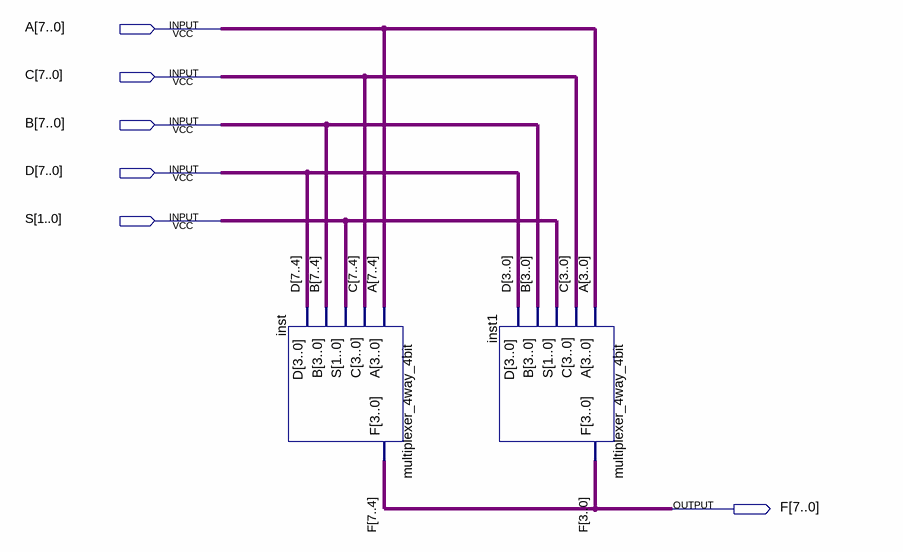
[diagram p0: schematic sheet]
// Quartus schematic multiplexer_4way_8bit.bdf as structural Verilog: 2 symbols, 6 pins
module multiplexer_4way_8bit (
  input  [7:0] A,
  input  [7:0] C,
  input  [7:0] B,
  input  [7:0] D,
  input  [1:0] S,
  output [7:0] F
);

  multiplexer_4way_4bit inst (.A(A[7:4]), .C(C[7:4]), .S(S), .B(B[7:4]), .D(D[7:4]), .F(F[7:4]));
  multiplexer_4way_4bit inst1 (.A(A[3:0]), .C(C[3:0]), .S(S), .B(B[3:0]), .D(D[3:0]), .F(F[3:0]));
endmodule
